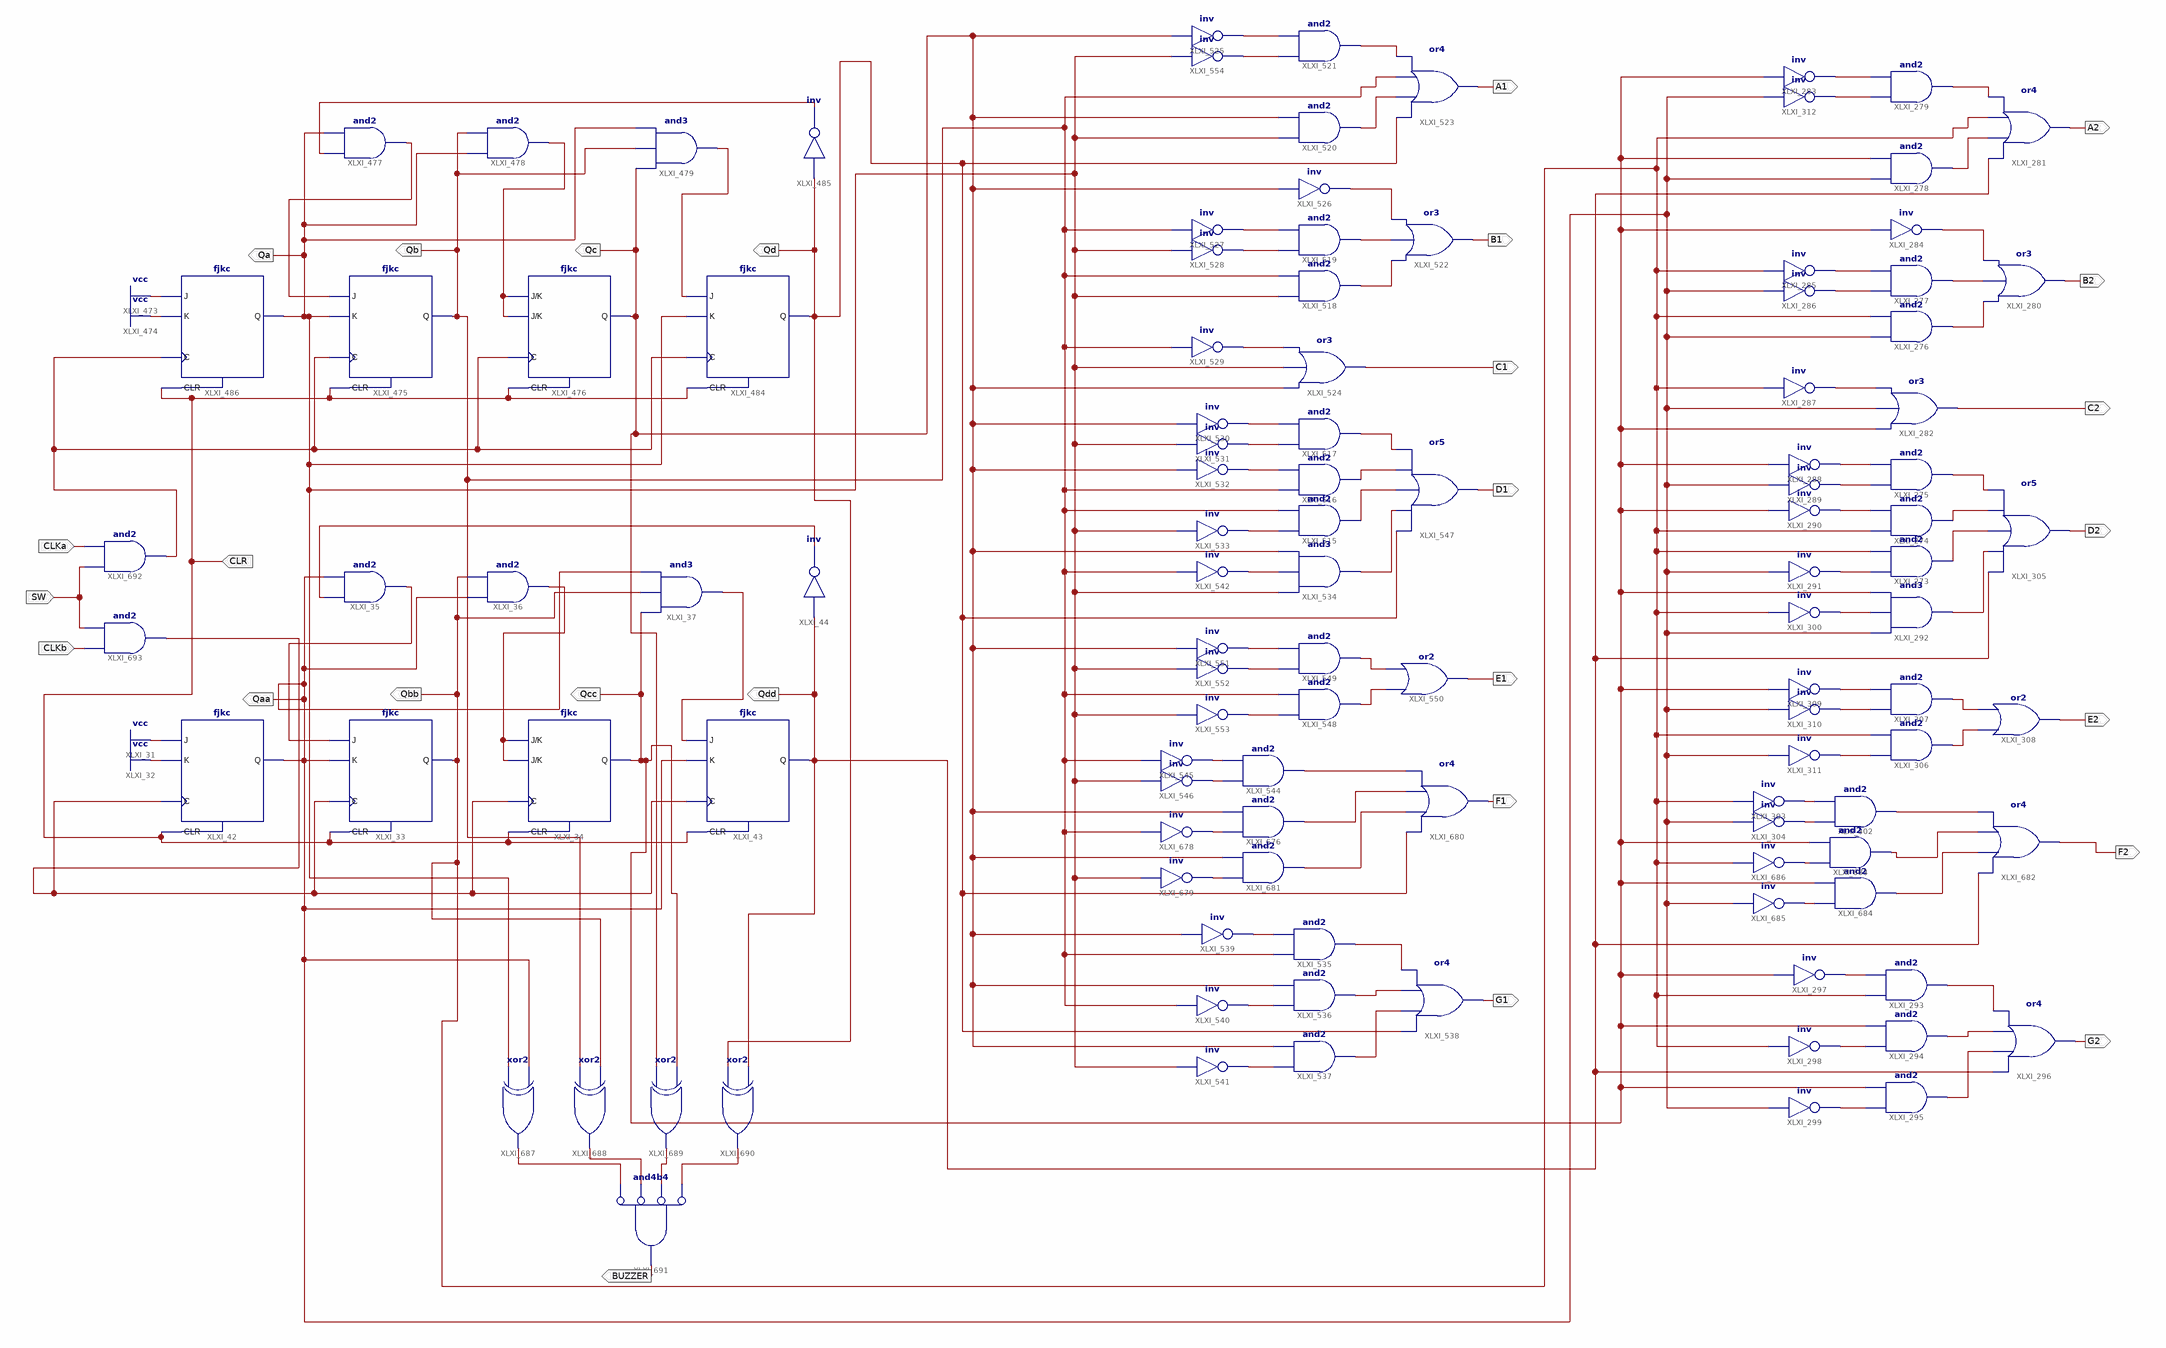
[diagram p0: schematic sheet 1]
// Xilinx ISE schematic lab66.sch (spartan6) as structural Verilog: 111 symbols, 27 ports
module lab66 (
  input  SW,
  input  CLKa,
  input  CLKb,
  input  CLR,
  output Qaa,
  output Qbb,
  output Qa,
  output Qb,
  output E2,
  output D2,
  output G2,
  output A2,
  output B2,
  output C2,
  output E1,
  output D1,
  output F1,
  output G1,
  output A1,
  output B1,
  output C1,
  output Qc,
  output Qd,
  output Qdd,
  output Qcc,
  output F2,
  output BUZZER
);

  wire CLK, CLK2, XLXN_58, XLXN_62, XLXN_72, XLXN_74, XLXN_349, XLXN_355, XLXN_356, XLXN_357, XLXN_358,
       XLXN_359, XLXN_360, XLXN_361, XLXN_362, XLXN_363, XLXN_364, XLXN_365, XLXN_366, XLXN_368, XLXN_369,
       XLXN_370, XLXN_371, XLXN_372, XLXN_373, XLXN_374, XLXN_375, XLXN_376, XLXN_382, XLXN_383, XLXN_384,
       XLXN_387, XLXN_388, XLXN_390, XLXN_391, XLXN_392, XLXN_393, XLXN_394, XLXN_395, XLXN_599, XLXN_603,
       XLXN_613, XLXN_615, XLXN_676, XLXN_677, XLXN_678, XLXN_679, XLXN_680, XLXN_681, XLXN_682, XLXN_683,
       XLXN_684, XLXN_685, XLXN_686, XLXN_687, XLXN_688, XLXN_689, XLXN_690, XLXN_691, XLXN_692, XLXN_693,
       XLXN_694, XLXN_695, XLXN_696, XLXN_697, XLXN_703, XLXN_704, XLXN_705, XLXN_707, XLXN_708, XLXN_710,
       XLXN_711, XLXN_712, XLXN_713, XLXN_714, XLXN_715, XLXN_918, XLXN_919, XLXN_920, XLXN_921, XLXN_925,
       XLXN_926, XLXN_927, XLXN_928, XLXN_932, XLXN_933, XLXN_934, XLXN_935;

  fjkc XLXI_33 (.C(CLK2), .CLR(CLR), .J(XLXN_58), .K(Qaa), .Q(Qbb));
  fjkc XLXI_34 (.C(CLK2), .CLR(CLR), .J(XLXN_62), .K(XLXN_62), .Q(Qcc));
  and XLXI_35 (XLXN_58, XLXN_74, Qaa);
  and XLXI_36 (XLXN_62, Qaa, Qbb);
  and XLXI_37 (XLXN_72, Qcc, Qbb, Qaa);
  fjkc XLXI_43 (.C(CLK2), .CLR(CLR), .J(XLXN_72), .K(Qaa), .Q(Qdd));
  not XLXI_44 (XLXN_74, Qdd);
  fjkc XLXI_42 (.C(CLK2), .CLR(CLR), .J(1'b1), .K(1'b1), .Q(Qaa));
  fjkc XLXI_476 (.C(CLK), .CLR(CLR), .J(XLXN_603), .K(XLXN_603), .Q(Qc));
  and XLXI_477 (XLXN_599, XLXN_615, Qa);
  and XLXI_478 (XLXN_603, Qa, Qb);
  and XLXI_479 (XLXN_613, Qc, Qb, Qa);
  fjkc XLXI_484 (.C(CLK), .CLR(CLR), .J(XLXN_613), .K(Qa), .Q(Qd));
  not XLXI_485 (XLXN_615, Qd);
  fjkc XLXI_475 (.C(CLK), .CLR(CLR), .J(XLXN_599), .K(Qa), .Q(Qb));
  fjkc XLXI_486 (.C(CLK), .CLR(CLR), .J(1'b1), .K(1'b1), .Q(Qa));
  not XLXI_312 (XLXN_365, Qaa);
  not XLXI_311 (XLXN_391, Qaa);
  not XLXI_310 (XLXN_392, Qaa);
  not XLXI_309 (XLXN_393, Qcc);
  or XLXI_308 (E2, XLXN_394, XLXN_395);
  and XLXI_307 (XLXN_395, XLXN_392, XLXN_393);
  and XLXI_306 (XLXN_394, XLXN_391, Qbb);
  or XLXI_305 (D2, Qdd, XLXN_390, XLXN_388, XLXN_387, XLXN_371);
  not XLXI_304 (XLXN_383, Qaa);
  not XLXI_303 (XLXN_382, Qbb);
  and XLXI_302 (XLXN_384, XLXN_383, XLXN_382);
  not XLXI_300 (XLXN_357, Qbb);
  not XLXI_299 (XLXN_355, Qaa);
  not XLXI_298 (XLXN_356, Qbb);
  not XLXI_297 (XLXN_349, Qcc);
  or XLXI_296 (G2, Qdd, XLXN_368, XLXN_369, XLXN_370);
  and XLXI_295 (XLXN_368, XLXN_355, Qcc);
  and XLXI_294 (XLXN_369, XLXN_356, Qcc);
  and XLXI_293 (XLXN_370, Qbb, XLXN_349);
  and XLXI_292 (XLXN_390, Qaa, XLXN_357, Qcc);
  not XLXI_291 (XLXN_358, Qaa);
  not XLXI_290 (XLXN_359, Qcc);
  not XLXI_289 (XLXN_360, Qaa);
  not XLXI_288 (XLXN_361, Qcc);
  not XLXI_287 (XLXN_362, Qbb);
  not XLXI_286 (XLXN_363, Qaa);
  not XLXI_285 (XLXN_364, Qbb);
  not XLXI_284 (XLXN_374, Qcc);
  not XLXI_283 (XLXN_366, Qcc);
  or XLXI_282 (C2, Qcc, Qaa, XLXN_362);
  or XLXI_281 (A2, Qdd, XLXN_375, Qbb, XLXN_376);
  or XLXI_280 (B2, XLXN_372, XLXN_373, XLXN_374);
  and XLXI_279 (XLXN_376, XLXN_365, XLXN_366);
  and XLXI_278 (XLXN_375, Qaa, Qcc);
  and XLXI_277 (XLXN_373, XLXN_363, XLXN_364);
  and XLXI_276 (XLXN_372, Qaa, Qbb);
  and XLXI_275 (XLXN_371, XLXN_360, XLXN_361);
  and XLXI_274 (XLXN_387, Qbb, XLXN_359);
  and XLXI_273 (XLXN_388, XLXN_358, Qbb);
  not XLXI_554 (XLXN_687, Qa);
  not XLXI_553 (XLXN_711, Qa);
  not XLXI_552 (XLXN_712, Qa);
  not XLXI_551 (XLXN_713, Qc);
  or XLXI_550 (E1, XLXN_714, XLXN_715);
  and XLXI_549 (XLXN_715, XLXN_712, XLXN_713);
  and XLXI_548 (XLXN_714, XLXN_711, Qb);
  or XLXI_547 (D1, Qd, XLXN_710, XLXN_708, XLXN_707, XLXN_692);
  not XLXI_546 (XLXN_704, Qa);
  not XLXI_545 (XLXN_703, Qb);
  and XLXI_544 (XLXN_705, XLXN_704, XLXN_703);
  not XLXI_542 (XLXN_679, Qb);
  not XLXI_541 (XLXN_677, Qa);
  not XLXI_540 (XLXN_678, Qb);
  not XLXI_539 (XLXN_676, Qc);
  or XLXI_538 (G1, Qd, XLXN_689, XLXN_690, XLXN_691);
  and XLXI_537 (XLXN_689, XLXN_677, Qc);
  and XLXI_536 (XLXN_690, XLXN_678, Qc);
  and XLXI_535 (XLXN_691, Qb, XLXN_676);
  and XLXI_534 (XLXN_710, Qa, XLXN_679, Qc);
  not XLXI_533 (XLXN_680, Qa);
  not XLXI_532 (XLXN_681, Qc);
  not XLXI_531 (XLXN_682, Qa);
  not XLXI_530 (XLXN_683, Qc);
  not XLXI_529 (XLXN_684, Qb);
  not XLXI_528 (XLXN_685, Qa);
  not XLXI_527 (XLXN_686, Qb);
  not XLXI_526 (XLXN_695, Qc);
  not XLXI_525 (XLXN_688, Qc);
  or XLXI_524 (C1, Qc, Qa, XLXN_684);
  or XLXI_523 (A1, Qd, XLXN_696, Qb, XLXN_697);
  or XLXI_522 (B1, XLXN_693, XLXN_694, XLXN_695);
  and XLXI_521 (XLXN_697, XLXN_687, XLXN_688);
  and XLXI_520 (XLXN_696, Qa, Qc);
  and XLXI_519 (XLXN_694, XLXN_685, XLXN_686);
  and XLXI_518 (XLXN_693, Qa, Qb);
  and XLXI_517 (XLXN_692, XLXN_682, XLXN_683);
  and XLXI_516 (XLXN_707, Qb, XLXN_681);
  and XLXI_515 (XLXN_708, XLXN_680, Qb);
  and XLXI_676 (XLXN_920, XLXN_918, Qc);
  not XLXI_678 (XLXN_918, Qb);
  not XLXI_679 (XLXN_919, Qa);
  or XLXI_680 (F1, Qd, XLXN_921, XLXN_920, XLXN_705);
  and XLXI_681 (XLXN_921, XLXN_919, Qc);
  or XLXI_682 (F2, Qdd, XLXN_926, XLXN_925, XLXN_384);
  and XLXI_684 (XLXN_926, XLXN_927, Qcc);
  not XLXI_685 (XLXN_927, Qaa);
  not XLXI_686 (XLXN_928, Qbb);
  and XLXI_683 (XLXN_925, XLXN_928, Qcc);
  xor XLXI_687 (XLXN_932, Qa, Qaa);
  xor XLXI_688 (XLXN_933, Qb, Qbb);
  xor XLXI_689 (XLXN_934, Qc, Qcc);
  xor XLXI_690 (XLXN_935, Qd, Qdd);
  and XLXI_691 (BUZZER, ~XLXN_932, ~XLXN_933, ~XLXN_934, ~XLXN_935);  // and4b4
  and XLXI_693 (CLK2, CLKb, SW);
  and XLXI_692 (CLK, SW, CLKa);
endmodule
